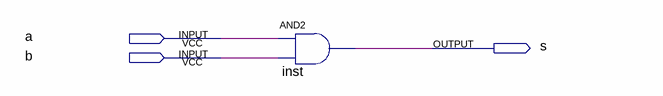
[diagram p0: schematic sheet]
// Quartus schematic Porte_ET.bdf as structural Verilog: 1 symbols, 3 pins
module Porte_ET (
  input  a,
  input  b,
  output s
);

  and inst (s, a, b);
endmodule
